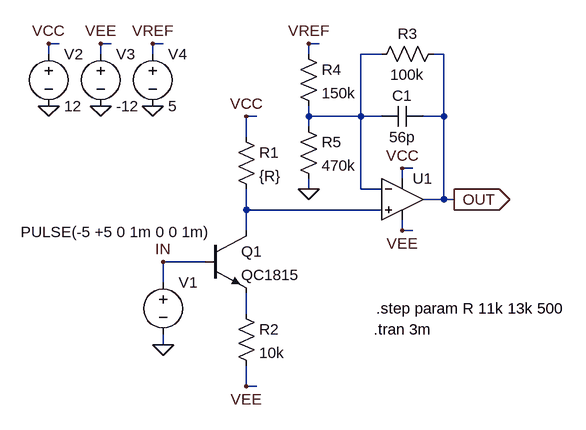
[diagram p0: schematic SAW_TRI_A2_01.asc]
SAW_TRI_A2_01.asc, the LTspice schematic file:
Version 4
SHEET 1 880 680
WIRE -48 -160 -64 -160
WIRE 32 -160 16 -160
WIRE 112 -160 96 -160
WIRE 352 -160 336 -160
WIRE -64 -144 -64 -160
WIRE 16 -144 16 -160
WIRE 96 -144 96 -160
WIRE 336 -144 336 -160
WIRE 448 -144 416 -144
WIRE 544 -144 528 -144
WIRE 256 -48 240 -48
WIRE 336 -48 336 -64
WIRE 416 -48 416 -144
WIRE 416 -48 336 -48
WIRE 448 -48 416 -48
WIRE 544 -48 544 -144
WIRE 544 -48 512 -48
WIRE 336 -32 336 -48
WIRE 240 -16 240 -48
WIRE 496 32 480 32
WIRE 480 48 480 32
WIRE 336 64 336 48
WIRE 416 64 416 -48
WIRE 448 64 416 64
WIRE 544 80 544 -48
WIRE 544 80 512 80
WIRE 560 80 544 80
WIRE 240 96 240 64
WIRE 448 96 240 96
WIRE 240 128 240 96
WIRE 480 128 480 112
WIRE 496 128 480 128
WIRE 176 176 112 176
WIRE 112 208 112 176
WIRE 240 256 240 224
WIRE 112 304 112 288
WIRE 240 368 240 336
WIRE 256 368 240 368
FLAG 112 304 0
FLAG 112 176 IN
FLAG 480 32 VCC
FLAG 480 128 VEE
FLAG 336 -160 VREF
FLAG 336 64 0
FLAG 240 -48 VCC
FLAG 240 368 VEE
FLAG 560 80 OUT
IOPIN 560 80 Out
FLAG -64 -64 0
FLAG 16 -64 0
FLAG 96 -64 0
FLAG -64 -160 VCC
FLAG 16 -160 VEE
FLAG 96 -160 VREF
SYMBOL npn 176 128 R0
SYMATTR InstName Q1
SYMATTR Value QC1815
SYMBOL voltage 112 192 R0
WINDOW 3 -219 -62 Left 2
WINDOW 123 0 0 Left 2
WINDOW 39 0 0 Left 2
SYMATTR InstName V1
SYMATTR Value PULSE(-5 +5 0 1m 0 0 1m)
SYMBOL res 224 -32 R0
SYMATTR InstName R1
SYMATTR Value {R}
SYMBOL res 224 240 R0
SYMATTR InstName R2
SYMATTR Value 10k
SYMBOL Opamps\\UniversalOpamp2 480 80 R0
SYMATTR InstName U1
SYMBOL cap 448 -64 M90
WINDOW 0 0 32 VBottom 2
WINDOW 3 32 32 VTop 2
SYMATTR InstName C1
SYMATTR Value 56p
SYMBOL res 544 -160 R90
WINDOW 0 0 56 VBottom 2
WINDOW 3 32 56 VTop 2
SYMATTR InstName R3
SYMATTR Value 100k
SYMBOL res 320 -160 R0
SYMATTR InstName R4
SYMATTR Value 150k
SYMBOL res 320 -48 R0
SYMATTR InstName R5
SYMATTR Value 470k
SYMBOL voltage -64 -160 R0
WINDOW 123 0 0 Left 2
WINDOW 39 0 0 Left 2
SYMATTR InstName V2
SYMATTR Value 12
SYMBOL voltage 16 -160 R0
WINDOW 123 0 0 Left 2
WINDOW 39 0 0 Left 2
SYMATTR InstName V3
SYMATTR Value -12
SYMBOL voltage 96 -160 R0
WINDOW 123 0 0 Left 2
WINDOW 39 0 0 Left 2
SYMATTR InstName V4
SYMATTR Value 5
TEXT 436 280 Left 2 !.tran 3m
TEXT 440 248 Left 2 !.step param R 11k 13k 500

The netlist it stands for:
* SAW_TRI_A2_01.asc
Q1 N002 IN N003 0 QC1815
V1 IN 0 PULSE(-5 +5 0 1m 0 0 1m)
R1 VCC N002 {R}
R2 N003 VEE 10k
XU1 N002 N001 VCC VEE OUT level.2 Avol=1Meg GBW=10Meg Slew=10Meg ilimit=25m rail=0 Vos=0 phimargin=45 en=0 enk=0 in=0 ink=0 Rin=500Meg  ; pins IN+ IN- V+ V- OUT
C1 N001 OUT 56p
R3 OUT N001 100k
R4 VREF N001 150k
R5 N001 0 470k
V2 VCC 0 12
V3 VEE 0 -12
V4 VREF 0 5
.model NPN NPN
.model PNP PNP
.lib standard.bjt
.tran 3m
.step param R 11k 13k 500
.lib UniversalOpamps2.sub
.backanno
.end